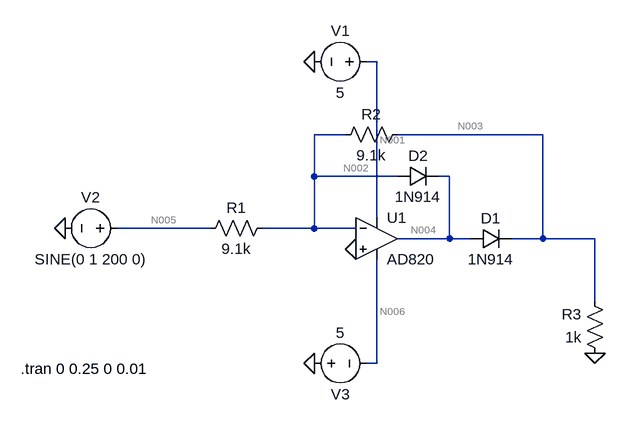
[diagram p0: schematic HalfWaveRectifierTest.asc]
HalfWaveRectifierTest.asc, the LTspice schematic file:
Version 4
SHEET 1 880 680
WIRE 256 -112 240 -112
WIRE 208 0 160 0
WIRE 512 0 288 0
WIRE 160 64 160 0
WIRE 288 64 160 64
WIRE 368 64 352 64
WIRE 256 128 256 -112
WIRE 0 144 -144 144
WIRE 160 144 160 64
WIRE 160 144 80 144
WIRE 224 144 160 144
WIRE 368 160 368 64
WIRE 368 160 288 160
WIRE 400 160 368 160
WIRE 512 160 512 0
WIRE 512 160 464 160
WIRE 592 160 512 160
WIRE 592 256 592 160
WIRE 256 352 256 192
WIRE 256 352 240 352
FLAG 160 -112 0
FLAG 592 336 0
FLAG -224 144 0
FLAG 224 176 0
FLAG 160 352 0
SYMBOL OpAmps\\AD820 256 96 R0
SYMATTR InstName U1
SYMBOL voltage 256 -112 R90
WINDOW 0 -32 56 VBottom 2
WINDOW 3 32 56 VTop 2
WINDOW 123 0 0 Left 0
WINDOW 39 0 0 Left 0
SYMATTR InstName V1
SYMATTR Value 5
SYMBOL res 96 128 R90
WINDOW 0 0 56 VBottom 2
WINDOW 3 32 56 VTop 2
SYMATTR InstName R1
SYMATTR Value 9.1k
SYMBOL res 304 -16 R90
WINDOW 0 0 56 VBottom 2
WINDOW 3 32 56 VTop 2
SYMATTR InstName R2
SYMATTR Value 9.1k
SYMBOL res 608 352 R180
WINDOW 0 36 76 Left 2
WINDOW 3 36 40 Left 2
SYMATTR InstName R3
SYMATTR Value 1k
SYMBOL diode 400 176 R270
WINDOW 0 32 32 VTop 2
WINDOW 3 0 32 VBottom 2
SYMATTR InstName D1
SYMATTR Value 1N914
SYMBOL diode 288 80 R270
WINDOW 0 32 32 VTop 2
WINDOW 3 0 32 VBottom 2
SYMATTR InstName D2
SYMATTR Value 1N914
SYMBOL voltage -128 144 R90
WINDOW 0 -32 56 VBottom 2
WINDOW 3 32 56 VTop 2
WINDOW 123 0 0 Left 0
WINDOW 39 0 0 Left 0
SYMATTR InstName V2
SYMATTR Value SINE(0 1 200 0)
SYMBOL voltage 144 352 R270
WINDOW 0 -32 56 VBottom 2
WINDOW 3 32 56 VTop 2
WINDOW 123 0 0 Left 0
WINDOW 39 0 0 Left 0
SYMATTR InstName V3
SYMATTR Value 5
TEXT -292 360 Left 2 !.tran 0 0.25 0 0.01

The netlist it stands for:
* HalfWaveRectifierTest.asc
XU1 0 N002 N001 N006 N004 AD820  ; pins In+ In- V+ V- OUT
V1 N001 0 5
R1 N002 N005 9.1k
R2 N003 N002 9.1k
R3 0 N003 1k
D1 N004 N003 1N914
D2 N002 N004 1N914
V2 N005 0 SINE(0 1 200 0)
V3 0 N006 5
.model D D
.lib standard.dio
.tran 0 0.25 0 0.01
.backanno
.end

* Results of the author's LTspice run, read from the files saved beside the schematic
* Operating Point, zero values left out:
*   V(n001) = 5 V
*   V(n006) = -5 V
*   V(n004) = 32.73 µV
*   I(D2) = -1.819 pA
*   I(D1) = 1.821 pA
*   I(R3) = -1.64 pA
*   I(V3) = -702.5 µA
*   I(V1) = -702.5 µA
*   Ix(u1:1) = 2 pA
*   Ix(u1:2) = 2 pA
*   Ix(u1:3) = 702.5 µA
*   Ix(u1:4) = -702.5 µA
*   Ix(u1:5) = -3.64 pA
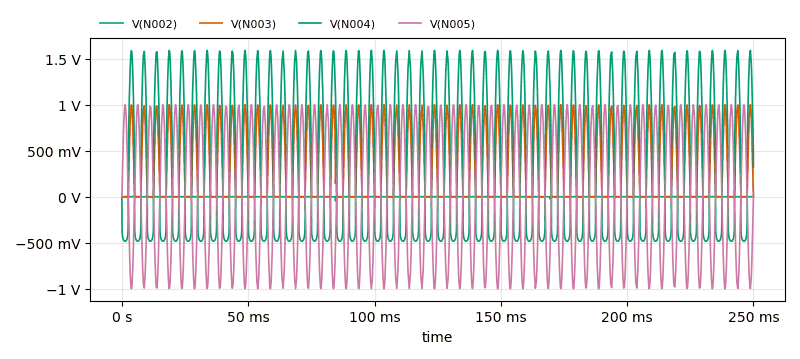
[diagram p1: Transient Analysis of HalfWaveRectifierTest.asc, plotted from the saved traces]
* Transient Analysis, 1 run:
*   V(N002): min -45.89 mV, max 5.473 mV, average -59.91 µV, rms 1.422 mV, last 1.134 mV
*   V(N003): min -40.56 mV, max 1 V, average 312.9 mV, rms 494.2 mV, last 2.725 mV
*   V(N004): min -484.2 mV, max 1.59 V, average 365.4 mV, rms 928.8 mV, last 323.4 mV
*   V(N005): min -1 V, max 1 V, average 999.2 µV, rms 704.6 mV, last 0 V